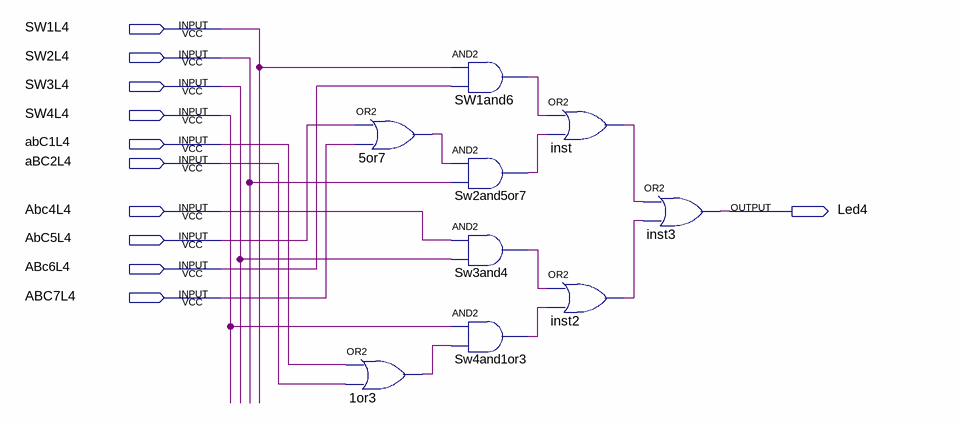
[diagram p0: schematic sheet]
// Quartus schematic Led4.bdf as structural Verilog: 9 symbols, 11 pins
module Led4 (
  input  SW1L4,
  input  SW2L4,
  input  SW3L4,
  input  SW4L4,
  input  abC1L4,
  input  aBC2L4,
  input  Abc4L4,
  input  AbC5L4,
  input  ABc6L4,
  input  ABC7L4,
  output Led4
);

  wire inst2_out, inst_out, n1or3_out, n5or7_out, SW1and6_out, Sw2and5or7_out, Sw3and4_out, Sw4and1or3_out;

  or u_5or7 (n5or7_out, AbC5L4, ABC7L4);
  or u_1or3 (n1or3_out, abC1L4, aBC2L4);
  and SW1and6 (SW1and6_out, SW1L4, ABc6L4);
  and Sw2and5or7 (Sw2and5or7_out, n5or7_out, SW2L4);
  and Sw3and4 (Sw3and4_out, Abc4L4, SW3L4);
  and Sw4and1or3 (Sw4and1or3_out, SW4L4, n1or3_out);
  or inst (inst_out, SW1and6_out, Sw2and5or7_out);
  or inst2 (inst2_out, Sw3and4_out, Sw4and1or3_out);
  or inst3 (Led4, inst_out, inst2_out);
endmodule
